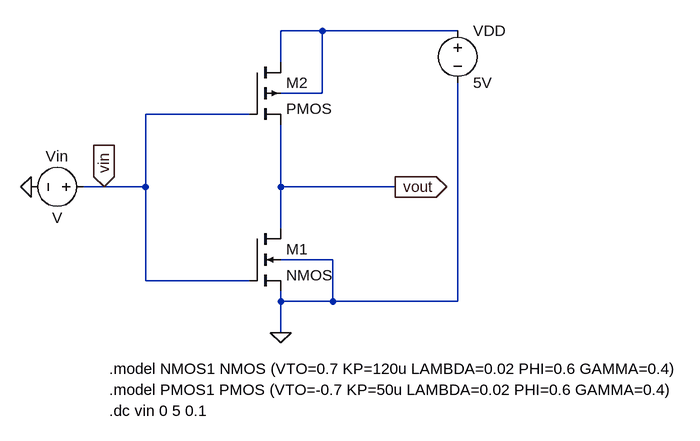
[diagram p0: schematic cmos-inverter-vtc.asc]
cmos-inverter-vtc.asc, the LTspice schematic file:
Version 4
SHEET 1 944 680
WIRE 416 32 352 32
WIRE 624 32 416 32
WIRE 352 80 352 32
WIRE 416 128 416 32
WIRE 416 128 352 128
WIRE 304 160 144 160
WIRE 80 272 48 272
WIRE 144 272 144 160
WIRE 144 272 80 272
WIRE 352 272 352 176
WIRE 528 272 352 272
WIRE 352 336 352 272
WIRE 432 384 352 384
WIRE 144 416 144 272
WIRE 304 416 144 416
WIRE 352 448 352 432
WIRE 432 448 432 384
WIRE 432 448 352 448
WIRE 624 448 624 112
WIRE 624 448 432 448
WIRE 352 496 352 448
FLAG -32 272 0
FLAG 352 496 0
FLAG 528 272 vout
IOPIN 528 272 Out
FLAG 80 272 vin
IOPIN 80 272 In
SYMBOL pmos4 304 80 R0
SYMATTR InstName M2
SYMBOL nmos4 304 336 R0
SYMATTR InstName M1
SYMBOL voltage 624 16 R0
SYMATTR InstName VDD
SYMATTR Value 5V
SYMBOL voltage 64 272 R90
WINDOW 0 -32 56 VBottom 2
WINDOW 3 32 56 VTop 2
SYMATTR InstName Vin
TEXT 88 552 Left 2 !.model NMOS1 NMOS (VTO=0.7 KP=120u LAMBDA=0.02 PHI=0.6 GAMMA=0.4)
TEXT 88 584 Left 2 !.model PMOS1 PMOS (VTO=-0.7 KP=50u LAMBDA=0.02 PHI=0.6 GAMMA=0.4)
TEXT 88 616 Left 2 !.dc vin 0 5 0.1

The netlist it stands for:
* cmos-inverter-vtc.asc
M2 N001 vin vout N001 PMOS
M1 vout vin 0 0 NMOS
VDD N001 0 5V
Vin vin 0 V
.model NMOS NMOS
.model PMOS PMOS
.lib standard.mos
.model NMOS1 NMOS (VTO=0.7 KP=120u LAMBDA=0.02 PHI=0.6 GAMMA=0.4)
.model PMOS1 PMOS (VTO=-0.7 KP=50u LAMBDA=0.02 PHI=0.6 GAMMA=0.4)
.dc vin 0 5 0.1
.backanno
.end

* Results of the author's LTspice run, read from the files saved beside the schematic
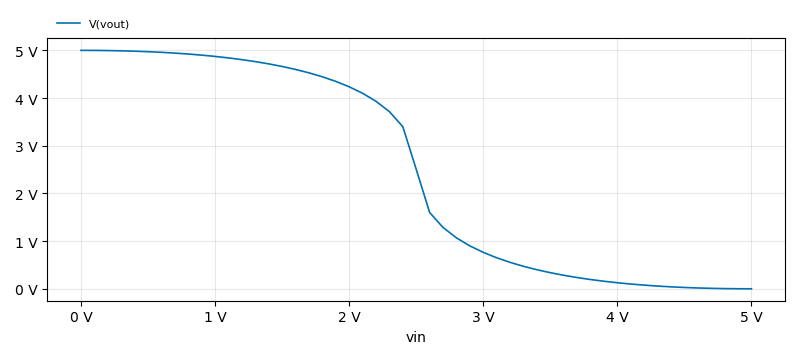
[diagram p1: DC transfer characteristic of cmos-inverter-vtc.asc, plotted from the saved traces]
* DC transfer characteristic, 1 run:
*   V(vout): 5 V at vin=0 V, -352.5 nV at vin=5 V, min -352.5 nV, max 5 V